# EAGLE design Comin_CTR v.1.0 (EAGLE 9.2.2)
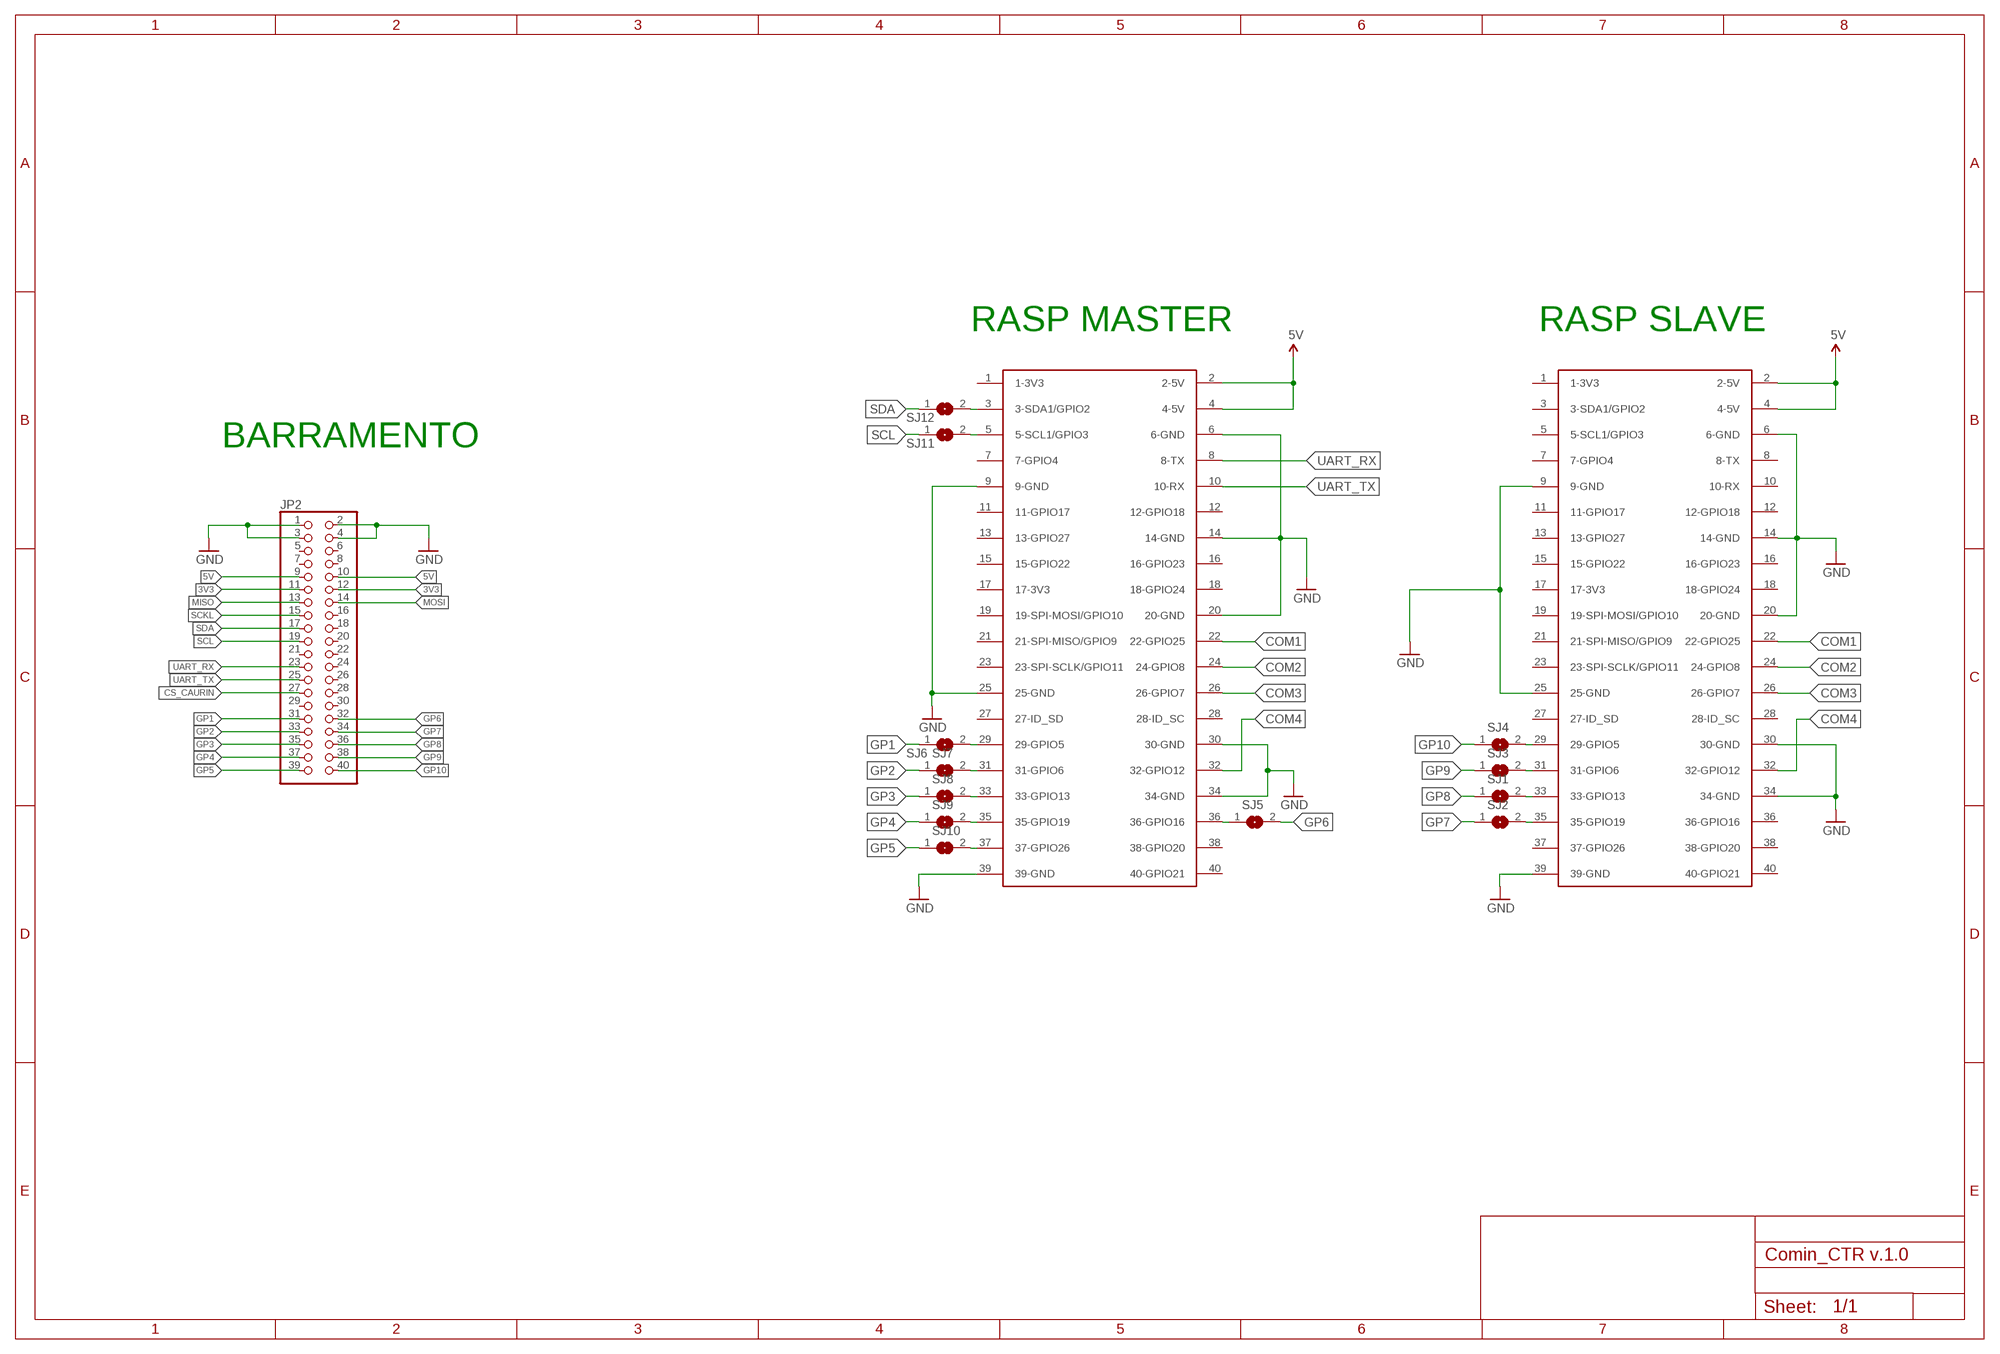
[diagram p0: schematic, sheet 1]

## Parts
JP2  PINHD-2X20  [2X20]
SJ1  SJ  [SJ]
SJ2  SJ  [SJ]
SJ3  SJ  [SJ]
SJ4  SJ  [SJ]
SJ5  SJ  [SJ]
SJ6  SJ  [SJ]
SJ7  SJ  [SJ]
SJ8  SJ  [SJ]
SJ9  SJ  [SJ]
SJ10  SJ  [SJ]
SJ11  SJ  [SJ]
SJ12  SJ  [SJ]
U$1  RASPBERRY-PI+PIZERO  [RASPBERRY-PI-ZERO]
U$2  RASPBERRY-PI+PIZERO  [RASPBERRY-PI-ZERO]

## Nets
3V3: JP2.11 JP2.12
5V: JP2.9 JP2.10 U$1.2(2-5V) U$1.4(4-5V) U$2.2(2-5V) U$2.4(4-5V)
COM1: U$1.22(22-GPIO25) U$2.22(22-GPIO25)
COM2: U$1.24(24-GPIO8) U$2.24(24-GPIO8)
COM3: U$1.26(26-GPIO7) U$2.26(26-GPIO7)
COM4: U$1.32(32-GPIO12) U$2.32(32-GPIO12)
CS_CAURIN: JP2.27
GND: JP2.1 JP2.2 JP2.3 JP2.4 U$1.6(6-GND) U$1.9(9-GND) U$1.14(14-GND) U$1.20(20-GND) U$1.25(25-GND) U$1.30(30-GND) U$1.34(34-GND) U$1.39(39-GND) U$2.6(6-GND) U$2.9(9-GND) U$2.14(14-GND) U$2.20(20-GND) U$2.25(25-GND) U$2.30(30-GND) U$2.34(34-GND) U$2.39(39-GND)
GP1: JP2.31 SJ6.1
GP2: JP2.33 SJ7.1
GP3: JP2.35 SJ8.1
GP4: JP2.37 SJ9.1
GP5: JP2.39 SJ10.1
GP6: JP2.32 SJ5.2
GP7: JP2.34 SJ2.1
GP8: JP2.36 SJ1.1
GP9: JP2.38 SJ3.1
GP10: JP2.40 SJ4.1
MISO: JP2.13
MOSI: JP2.14
N$1: SJ1.2 U$1.33(33-GPIO13)
N$2: SJ2.2 U$1.35(35-GPIO19)
N$3: SJ3.2 U$1.31(31-GPIO6)
N$4: SJ5.1 U$2.36(36-GPIO16)
N$5: SJ4.2 U$1.29(29-GPIO5)
N$6: SJ6.2 U$2.29(29-GPIO5)
N$7: SJ7.2 U$2.31(31-GPIO6)
N$8: SJ8.2 U$2.33(33-GPIO13)
N$9: SJ9.2 U$2.35(35-GPIO19)
N$10: SJ10.2 U$2.37(37-GPIO26)
N$11: SJ11.2 U$2.5(5-SCL1/GPIO3)
N$12: SJ12.2 U$2.3(3-SDA1/GPIO2)
SCKL: JP2.15
SCL: JP2.19 SJ11.1
SDA: JP2.17 SJ12.1
UART_RX: JP2.23 U$2.8(8-TX)
UART_TX: JP2.25 U$2.10(10-RX)
Unconnected: JP2.5 JP2.6 JP2.7 JP2.8 JP2.16 JP2.18 JP2.20 JP2.21 JP2.22 JP2.24 JP2.26 JP2.28 JP2.29 JP2.30 U$1.1(1-3V3) U$1.3(3-SDA1/GPIO2) U$1.5(5-SCL1/GPIO3) U$1.7(7-GPIO4) U$1.8(8-TX) U$1.10(10-RX) U$1.11(11-GPIO17) U$1.12(12-GPIO18) U$1.13(13-GPIO27) U$1.15(15-GPIO22) U$1.16(16-GPIO23) U$1.17(17-3V3) U$1.18(18-GPIO24) U$1.19(19-SPI-MOSI/GPIO10) U$1.21(21-SPI-MISO/GPIO9) U$1.23(23-SPI-SCLK/GPIO11) U$1.27(27-ID_SD) U$1.28(28-ID_SC) U$1.36(36-GPIO16) U$1.37(37-GPIO26) U$1.38(38-GPIO20) U$1.40(40-GPIO21) U$2.1(1-3V3) U$2.7(7-GPIO4) U$2.11(11-GPIO17) U$2.12(12-GPIO18) U$2.13(13-GPIO27) U$2.15(15-GPIO22) U$2.16(16-GPIO23) U$2.17(17-3V3) U$2.18(18-GPIO24) U$2.19(19-SPI-MOSI/GPIO10) U$2.21(21-SPI-MISO/GPIO9) U$2.23(23-SPI-SCLK/GPIO11) U$2.27(27-ID_SD) U$2.28(28-ID_SC) U$2.38(38-GPIO20) U$2.40(40-GPIO21)

## Notes on the sheet
- RASP MASTER | RASP SLAVE
- BARRAMENTO

## Library data of the parts
JP2 = pinhead:PINHD-2X20: PIN HEADER
SJ1-SJ12 = jumper:SJ: SMD solder JUMPER
U$1 U$2 = Ava:RASPBERRY-PI+: Samtec SSW-120-01-T-D

## Board
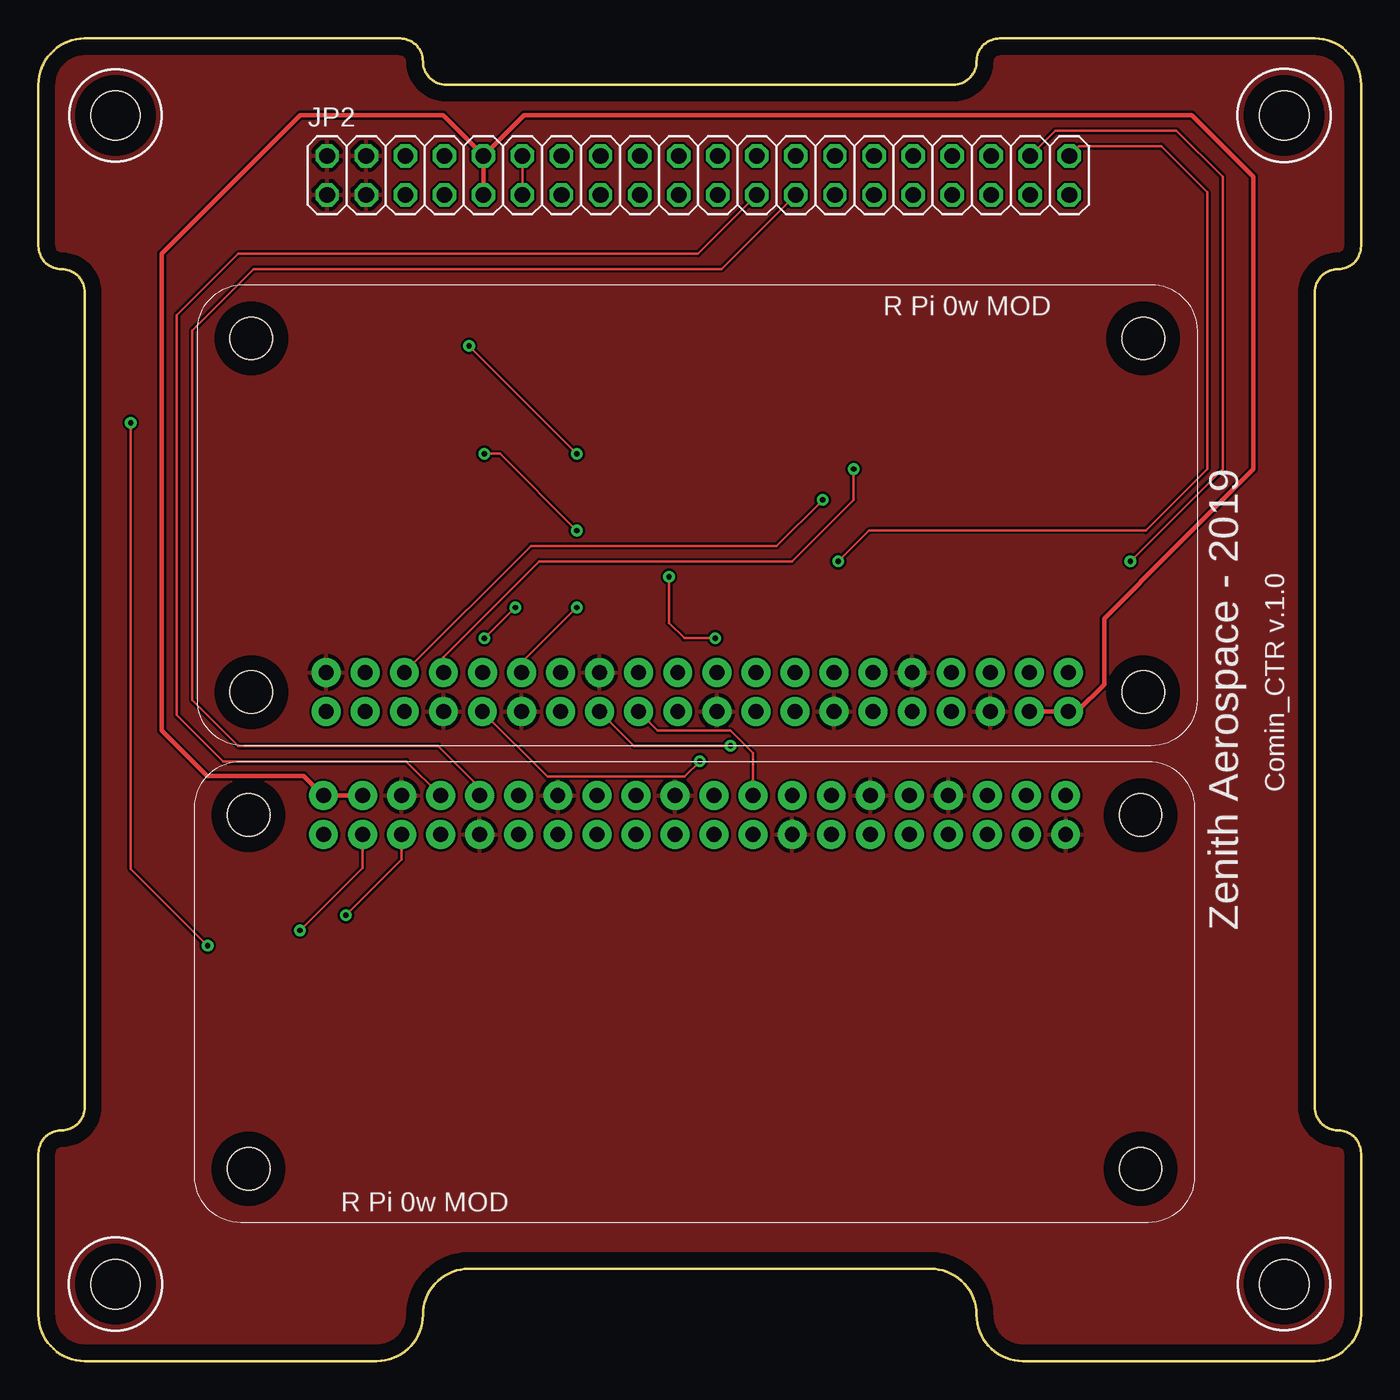
[diagram p1: board, top side]
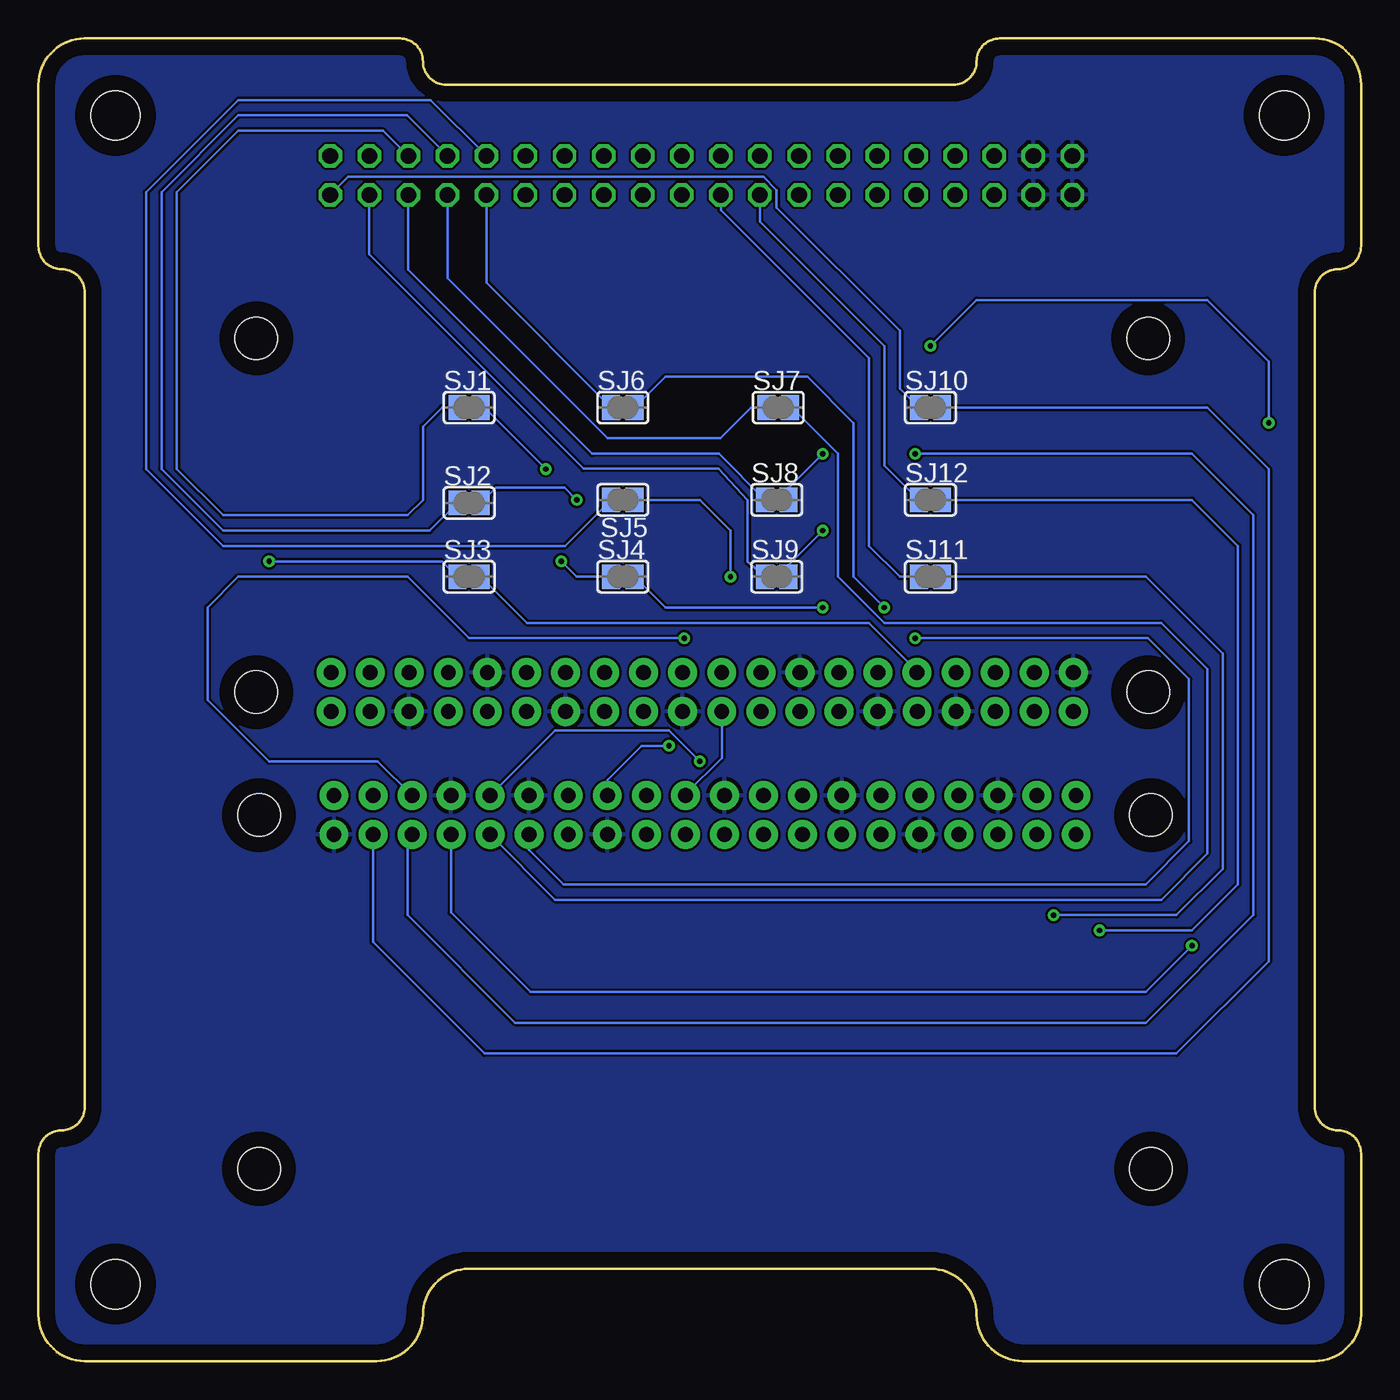
[diagram p2: board, bottom side, seen from below]

Size 86 x 86 mm. Coordinates in mm from the lower left corner, seen from the top.
Outline: 0,83 0,72.5 arc90 1.5,71 arc-90 3,69.5 3,16.5 arc-90 1.5,15 arc90 0,13.5 0,3 arc90 3,0 22,0 arc90 25,3 arc-90 28,6 58,6 arc-90 61,3 arc90 64,0 83,0 arc90 86,3 86,13.5 arc90 84.5,15 arc-90 83,16.5 83,69.5 arc-90 84.5,71 arc90 86,72.5 86,83 arc90 83,86 62.5,86 arc90 61,84.5 arc-90 59.5,83 26.5,83 arc-90 25,84.5 arc90 23.5,86 3,86 arc90 0,83
Copper layers (1*16): Top 0.035mm / dielectric 1.5mm / Bottom 0.035mm
Design rules "default *": minimum track width 6mil, minimum drill 0.35mm, track to track 6mil, track to pad 6mil, pad to pad 6mil, via to via 6mil, smd to smd 6mil, copper to edge 40mil, drill to drill 6mil, minimum pad ring 10mil, minimum via ring 8mil, stop-mask expansion 4mil, vias tented up to drill 100mil, thermal gap 10mil
Holes 3.2 mm at 5,5 81,5 81,81 5,81

### Footprints (pad centres in the part's own frame; a part is rotated, then mirrored left to right if it is on the bottom)
2X20 = drill 1.016 octagon: 1 -24.13,-1.27; 2 -24.13,1.27; 3 -21.59,-1.27; 4 -21.59,1.27; 5 -19.05,-1.27; 6 -19.05,1.27; 7 -16.51,-1.27; 8 -16.51,1.27; 9 -13.97,-1.27; 10 -13.97,1.27; 11 -11.43,-1.27; 12 -11.43,1.27; 13 -8.89,-1.27; 14 -8.89,1.27; 15 -6.35,-1.27; 16 -6.35,1.27; 17 -3.81,-1.27; 18 -3.81,1.27; 19 -1.27,-1.27; 20 -1.27,1.27; 21 1.27,-1.27; 22 1.27,1.27; 23 3.81,-1.27; 24 3.81,1.27; 25 6.35,-1.27; 26 6.35,1.27; 27 8.89,-1.27; 28 8.89,1.27; 29 11.43,-1.27; 30 11.43,1.27; 31 13.97,-1.27; 32 13.97,1.27; 33 16.51,-1.27; 34 16.51,1.27; 35 19.05,-1.27; 36 19.05,1.27; 37 21.59,-1.27; 38 21.59,1.27; 39 24.13,-1.27; 40 24.13,1.27
SJ = smd 1.168 x 1.6: 1 -0.762,0; 2 0.762,0
RASPBERRY-PI-ZERO = drill 0.97 pad 1.88: 1 -23.97,23.23; 2 -23.97,25.77; 3 -21.43,23.23; 4 -21.43,25.77; 5 -18.89,23.23; 6 -18.89,25.77; 7 -16.35,23.23; 8 -16.35,25.77; 9 -13.81,23.23; 10 -13.81,25.77; 11 -11.27,23.23; 12 -11.27,25.77; 13 -8.73,23.23; 14 -8.73,25.77; 15 -6.19,23.23; 16 -6.19,25.77; 17 -3.65,23.23; 18 -3.65,25.77; 19 -1.11,23.23; 20 -1.11,25.77; 21 1.43,23.23; 22 1.43,25.77; 23 3.97,23.23; 24 3.97,25.77; 25 6.51,23.23; 26 6.51,25.77; 27 9.05,23.23; 28 9.05,25.77; 29 11.59,23.23; 30 11.59,25.77; 31 14.13,23.23; 32 14.14,25.77; 33 16.67,23.23; 34 16.67,25.77; 35 19.21,23.23; 36 19.21,25.77; 37 21.75,23.23; 38 21.75,25.77; 39 24.29,23.23; 40 24.29,25.77 | hole 2.75: -28.84,24.5; 29.16,24.5; -28.84,1.5; 29.16,1.5

### Placement (x,y rotation side)
JP2  42.9,77.1 0 top
SJ1  58,62 0 bottom
SJ2  58,55.8 0 bottom
SJ3  58,51 0 bottom
SJ4  48,51 0 bottom
SJ5  48,56 180 bottom
SJ6  48,62 0 bottom
SJ7  37.9,62 0 bottom
SJ8  38,56 0 bottom
SJ9  38,51 0 bottom
SJ10  28,62 0 bottom
SJ11  28,51 0 bottom
SJ12  28,56 0 bottom
U$1  43,68 180 top
U$2  42.5,11 0 top

### Tracks (layer width: path | path; a pad name or v marks a point on that pad's centre or on a via)
3V3
  Top 0.152: JP2.12 JP2.11
5V
  Top 0.305: JP2.9 JP2.10 | JP2.10 26.3,81 17,81 8,72 8,41 10.96,38.04 17.26,38.04 U$2.2 U$2.4 | U$1.4 U$1.2 67.53,42.23 69.3,44 69.3,48.3 74,53 79,58 79,77 75,81 31.56,81 JP2.10
COM1
  Bottom 0.152: U$1.22 41.57,39.23 43.93,36.87 U$2.22
COM2
  Top 0.152: U$1.24 40.26,41 45,41 46.47,39.53 U$2.24
COM3  (via drill 0.35)
  Top 0.152: U$1.26 38.72,40 v45,40
  Bottom 0.152: v45,40 46.78,40 49.01,37.77 U$2.26
COM4  (via drill 0.35)
  Top 0.152: U$1.32 33.09,38 42,38 v43,39
  Bottom 0.152: U$2.32 52.41,41 45,41 v43,39
GND
  pour Top: 64,0 83,0 arc90 86,3 86,13.5 arc90 84.5,15 arc-90 83,16.5 83,69.5 arc-90 84.5,71 arc90 86,72.5 86,83 arc90 83,86 62.5,86 arc90 61,84.5 arc-90 59.5,83 26.5,83 arc-90 25,84.5 arc90 23.5,86 3,86 arc90 0,83 0,72.5 arc90 1.5,71 arc-90 3,69.5 3,16.5 arc-90 1.5,15 arc90 0,13.5 0,3 arc90 3,0 22,0 arc90 25,3 arc-90 28,6 58,6 arc-90 61,3 arc90
  pour Bottom: 64,0 83,0 arc90 86,3 86,13.5 arc90 84.5,15 arc-90 83,16.5 83,69.5 arc-90 84.5,71 arc90 86,72.5 86,83 arc90 83,86 62.5,86 arc90 61,84.5 arc-90 59.5,83 26.5,83 arc-90 25,84.5 arc90 23.5,86 3,86 arc90 0,83 0,72.5 arc90 1.5,71 arc-90 3,69.5 3,16.5 arc-90 1.5,15 arc90 0,13.5 0,3 arc90 3,0 22,0 arc90 25,3 arc-90 28,6 58,6 arc-90 61,3 arc90
GP1
  Bottom 0.152: SJ6.1 56.87,70.11 JP2.31
GP2
  Bottom 0.152: JP2.33 59.41,70.41 49,60 41.66,60 39.66,62 SJ7.1
GP3
  Bottom 0.152: SJ8.1 41.76,59 50,59 61.95,70.95 JP2.35
GP4
  Bottom 0.152: SJ9.1 39.9,52 39.9,56 41.79,58.03 50.56,58.03 64.49,71.96 JP2.37
GP5
  Bottom 0.152: JP2.39 65.86,77 38.86,77 38,76.14 38,75 30,67 30,63.24 SJ10.1
GP6
  Bottom 0.152: JP2.32 60.5,82 73,82 79,76 79,58 74,53 51.76,53 SJ5.2
GP7
  Bottom 0.152: JP2.34 62.04,81 73,81 78,76 78,58 74,54 60.56,54 SJ2.1
GP8
  Bottom 0.152: JP2.36 63.58,80 73,80 77,76 77,58 74,55 62,55 61,56 61,60.76 59.76,62 SJ1.1
GP9  (via drill 0.35)
  Top 0.152: JP2.38 66.12,80 74,80 77,77 77,58 v71,52
  Bottom 0.152: SJ3.1 59.76,52 v71,52
GP10  (via drill 0.35)
  Top 0.152: JP2.40 67.66,79 73,79 76,76 76,58 72,54 54,54 v52,52
  Bottom 0.152: v52,52 51,51 SJ4.1
N$1  (via drill 0.35)
  Top 0.152: U$1.33 26.33,45.77 32.56,52 49,52 53,56 v53,58
  Bottom 0.152: v53,58 57,62 SJ1.2
N$2  (via drill 0.35)
  Top 0.152: v51,56 48,53 32.02,53 U$1.35
  Bottom 0.152: SJ2.2 56.24,56.8 51.8,56.8 v51,56
N$3
  Bottom 0.152: SJ3.2 54.24,48 32,48 28.87,44.87 U$1.31
N$4  (via drill 0.35)
  Top 0.152: v41,51 41,48 42,47 v44,47
  Bottom 0.152: SJ5.1 43,56 41,54 v41,51 | U$2.36 63.94,39 71,39 75,43 75,49 73,51 62,51 58,47 v44,47
N$5  (via drill 0.35)
  Top 0.152: v35,49 31.41,45.41 U$1.29
  Bottom 0.152: SJ4.2 45.24,49 v35,49
N$6  (via drill 0.35)
  Top 0.152: v29,47 v31,49
  Bottom 0.152: SJ6.2 45.24,64 36,64 33,61 33,51 v31,49 | U$2.29 54.09,33.23 51.86,31 14,31 11.19,33.81 11.19,44.34 13.85,47 v29,47
N$7
  Bottom 0.152: SJ7.2 37,62 34,59 34,51 31,48 13,48 10,45 10,33 13,30 52.4,30 U$2.31
N$8  (via drill 0.35)
  Top 0.152: v11,27 6,32 v6,61 | v35,59 v28,66
  Bottom 0.152: U$2.33 59.17,29.17 54,24 14,24 v11,27 | v6,61 6,65 10,69 25,69 v28,66 | SJ8.2 37.24,56.76 v35,59
N$9  (via drill 0.35)
  Top 0.152: v29,59 30,59 v35,54
  Bottom 0.152: U$2.35 62,33.94 62,29 55,22 14,22 7,29 7,55 11,59 v29,59 | v35,54 37.24,51.76 SJ9.2
N$10
  Bottom 0.152: SJ10.2 10,62 6,58 6,26 12,20 57,20 64.25,27.25 U$2.37
N$11  (via drill 0.35)
  Top 0.152: U$2.5 23.61,32.61 v20,29
  Bottom 0.152: SJ11.2 14,51 9,46 9,32 12,29 v20,29
N$12  (via drill 0.35)
  Top 0.152: v17,28 21.07,32.07 U$2.3
  Bottom 0.152: SJ12.2 11,56 8,53 8,31 11,28 v17,28
SCL
  Bottom 0.152: SJ11.1 30,51 32,53 32,65.2 41.63,74.83 JP2.19
SDA
  Bottom 0.152: SJ12.1 31,58.24 31,66 39.09,74.09 JP2.17
UART_RX
  Top 0.152: JP2.23 42.88,72 13,72 9,68 9,42 12,39 23.92,39 U$2.8
UART_TX
  Top 0.152: JP2.25 44.42,71 14,71 10,67 10,43 13,40 26,40 28.69,37.31 U$2.10

### Text on the board
tNames: Comin_CTR v.1.0 | Zenith Aerospace - 2019